# EAGLE design P1 (EAGLE 9.4.2)
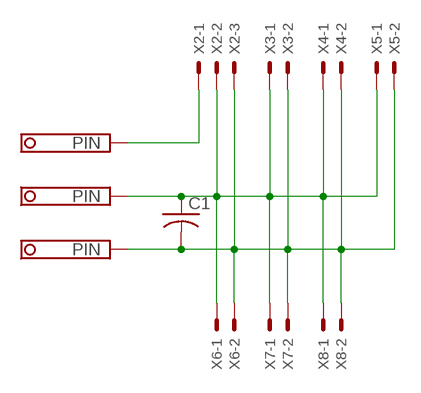
[diagram p0: schematic, sheet 1]

## Parts
C1  C-US050-024X044  [C050-024X044]
X1  TERMINAL-BLOCK-3.5MM-3-PIN-ROUND-PAD  [TERMINAL-BLOCK-3-PIN-3.5MM-ROUND-PAD]
X2  JST-XH-03-PIN-ROUND-PAD  [JST-XH-03-PACKAGE-ROUND-PAD]
X3  JST-XH-02-PIN-ROUND-PAD  [JST-XH-02-PACKAGE-ROUND-PAD]
X4  JST-XH-02-PIN-ROUND-PAD  [JST-XH-02-PACKAGE-ROUND-PAD]
X5  JST-XH-02-PIN-ROUND-PAD  [JST-XH-02-PACKAGE-ROUND-PAD]
X6  JST-XH-02-PIN-ROUND-PAD  [JST-XH-02-PACKAGE-ROUND-PAD]
X7  JST-XH-02-PIN-ROUND-PAD  [JST-XH-02-PACKAGE-ROUND-PAD]
X8  JST-XH-02-PIN-ROUND-PAD  [JST-XH-02-PACKAGE-ROUND-PAD]

## Nets
N$3: X1.1 X2.1
N$4: C1.2 X1.3 X2.3 X3.2 X4.2 X5.2 X6.2 X7.2 X8.2
N$5: C1.1 X1.2 X2.2 X3.1 X4.1 X5.1 X6.1 X7.1 X8.1

## Library data of the parts
C1 = adafruit:C-US: CAPACITOR, American symbol
X1 = Rembrandt Electronics - Terminal Block 3-5mm v1-0:TERMINAL-BLOCK-3.5MM-3-PIN: Terminal Block 3.5mm Pitch: 3,5 mm Number of pins: 3 Created by Rembrandt Electronics www.rembrandtelectronics.com
X2 = Rembrandt Electronics - Terminal Block 2.54 v1-0:JST-XH-03-PIN: JST XH Connector 2 Pin Wire to board connector. Pitch: 2,54 mm, (0.100") Number of pins: 3 Created by Rembrandt Electronics www.rembrandtelectronics.com
X3-X8 = Rembrandt Electronics - Terminal Block 2.54 v1-0:JST-XH-02-PIN: JST XH Connector 2 Pin Wire to board connector. Pitch: 2,54 mm, (0.100") Number of pins: 2 Created by Rembrandt Electronics www.rembrandtelectronics.com

## Board
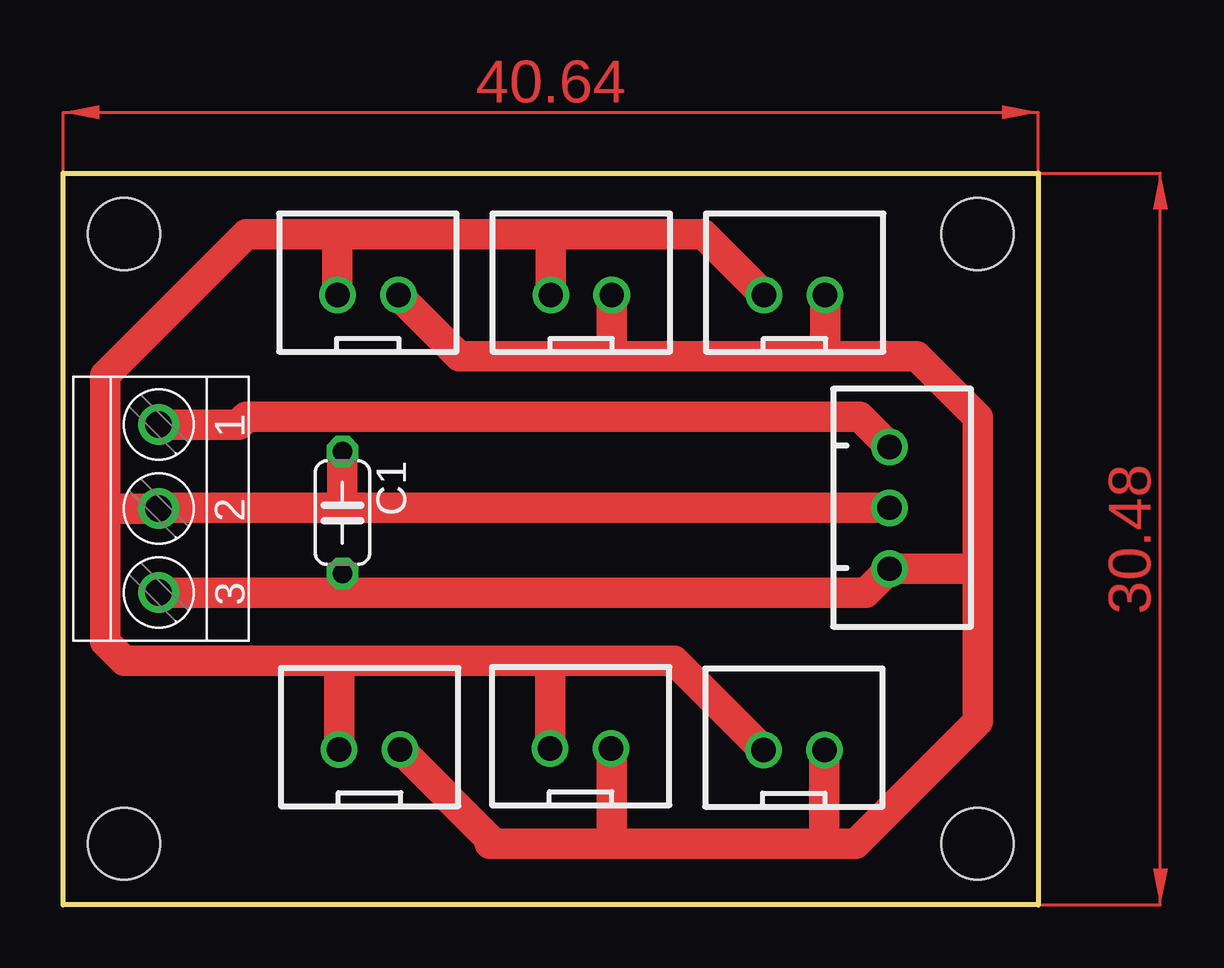
[diagram p1: board, top side]

Size 40.64 x 30.48 mm. Coordinates in mm from the lower left corner, seen from the top.
Outline: 0,30.48 40.64,30.48 40.64,0 0,0 0,30.48
Copper layers (1*16): Top 0.035mm / dielectric 1.5mm / Bottom 0.035mm
Design rules "default": minimum track width 6mil, minimum drill 0.35mm, track to track 6mil, track to pad 6mil, pad to pad 6mil, via to via 6mil, smd to smd 6mil, copper to edge 40mil, drill to drill 6mil, minimum pad ring 10mil, minimum via ring 8mil, stop-mask expansion 4mil, vias tented up to drill 0mil, thermal gap 10mil
Holes 3 mm at 2.54,27.94 2.54,2.54 38.1,27.94 38.1,2.54

### Footprints (pad centres in the part's own frame; a part is rotated, then mirrored left to right if it is on the bottom)
C050-024X044 = drill 0.813 octagon: 1 -2.54,0; 2 2.54,0
TERMINAL-BLOCK-3-PIN-3.5MM-ROUND-PAD = drill 1.1 pad 1.7: 1 -3.5,-0.1; 2 0,-0.1; 3 3.5,-0.1
JST-XH-03-PACKAGE-ROUND-PAD = drill 1.016: 1 -2.54,0; 2 0,0; 3 2.54,0
JST-XH-02-PACKAGE-ROUND-PAD = drill 1.016: 1 -1.27,0; 2 1.27,0

### Placement (x,y rotation side)
C1  11.64,16.34 270 top
X1  4.08,16.51 270 top
X2  34.44,16.54 270 top
X3  12.7,25.4 0 top
X4  21.59,25.4 0 top
X5  30.48,25.4 0 top
X6  12.77,6.47 0 top
X7  21.56,6.51 0 top
X8  30.45,6.45 0 top

### Tracks (layer width: path | path; a pad name or v marks a point on that pad's centre or on a via)
N$3
  Top 1.27: X1.1 7.31,20.01 7.63,20.33 33.19,20.33 X2.1
N$4
  Top 1.27: 11.64,13.01 33.45,13.01 X2.3 38.1,14 | 11.64,13.01 X1.3 | C1.2 11.64,13.01 | X3.2 16.51,22.86 22.86,22.86 | 22.86,22.86 31.75,22.86 | 31.75,22.86 35.56,22.86 38.1,20.32 38.1,15.24 38.1,14 | X4.2 22.86,22.86 | X5.2 31.75,22.86 | X6.2 17.78,2.73 17.78,2.54 22.86,2.54 | 22.86,2.54 31.72,2.54 | 31.72,2.54 33.02,2.54 38.1,7.62 38.1,14 | X7.2 22.86,6.51 22.86,2.54 | X8.2 31.72,2.54
N$5
  Top 1.27: X2.2 11.64,16.54 | 11.64,16.54 4.01,16.54 X1.2 1.75,16.51 | C1.1 11.64,16.54 | X5.1 26.67,27.94 20.32,27.94 | 20.32,27.94 11.43,27.94 | 11.43,27.94 7.62,27.94 1.75,22.07 1.75,17.78 1.75,16.51 | X3.1 11.43,27.94 | X4.1 20.32,27.94 | X8.1 25.47,10.16 20.29,10.16 | 1.75,16.51 1.75,10.95 2.54,10.16 11.5,10.16 | 20.29,10.16 11.5,10.16 | X6.1 11.5,10.16 | X7.1 20.29,10.16
(copper drawn outside any net)
  shapes: Top area x2